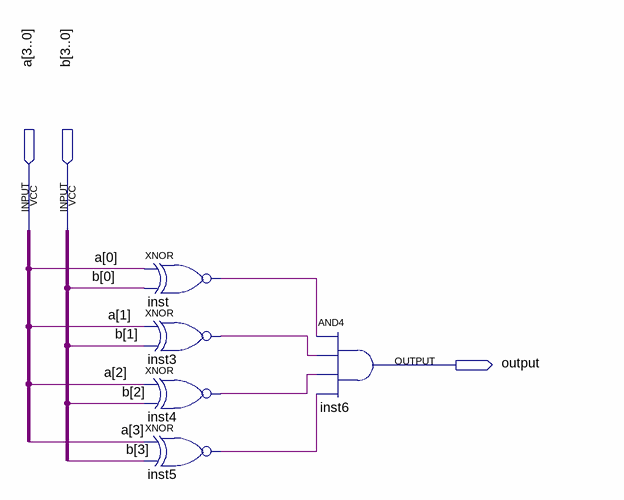
[diagram p0: schematic sheet]
// Quartus schematic comparador.bdf as structural Verilog: 5 symbols, 3 pins
module comparador (
  input  [3:0] a,
  input  [3:0] b,
  output \output 
);

  wire inst3_out, inst4_out, inst5_out, inst_out;

  xnor inst (inst_out, a[0], b[0]);
  xnor inst3 (inst3_out, a[1], b[1]);
  xnor inst4 (inst4_out, a[2], b[2]);
  xnor inst5 (inst5_out, a[3], b[3]);
  and inst6 (\output , inst_out, inst3_out, inst4_out, inst5_out);
endmodule
